# EAGLE design 2022国技館足回り (EAGLE 9.6.2)
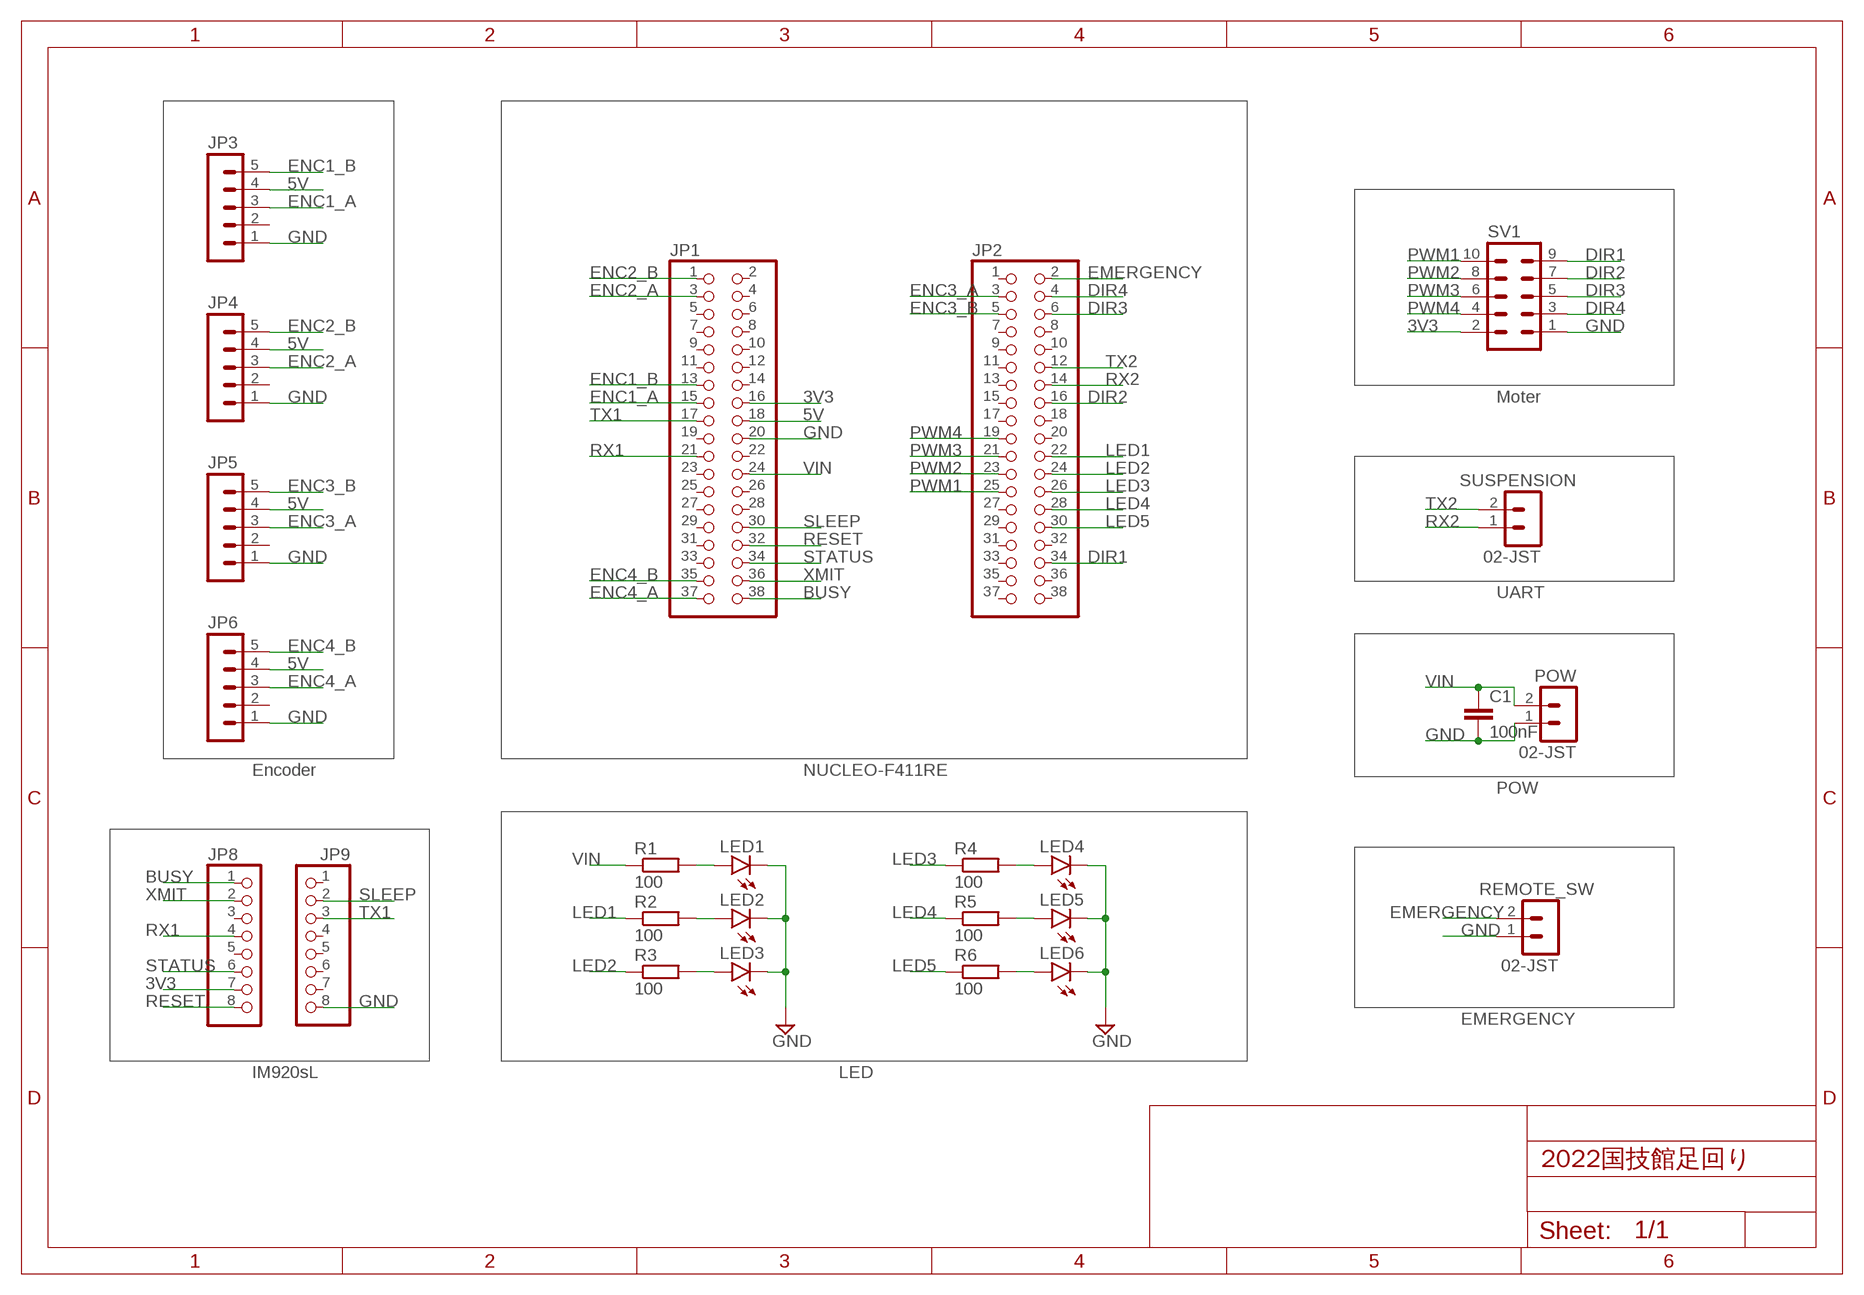
[diagram p0: schematic, sheet 1]

## Parts
C1  100nF  C-EU025-024X044  [C025-024X044]
JP1  PINHD-2X19  [2X19]
JP2  PINHD-2X19  [2X19]
JP3  05-JST  [B5B-XH]
JP4  05-JST  [B5B-XH]
JP5  05-JST  [B5B-XH]
JP6  05-JST  [B5B-XH]
JP8  PINHD-1X8  [1X08]
JP9  PINHD-1X8  [1X08]
LED1  LED5MM  [LED5MM]
LED2  LED5MM  [LED5MM]
LED3  LED5MM  [LED5MM]
LED4  LED5MM  [LED5MM]
LED5  LED5MM  [LED5MM]
LED6  LED5MM  [LED5MM]
POW  02-JST  [B2B-XH]
R1  100  R-EU_0204/7  [0204/7]
R2  100  R-EU_0207/2V  [0207/2V]
R3  100  R-EU_0207/2V  [0207/2V]
R4  100  R-EU_0207/2V  [0207/2V]
R5  100  R-EU_0207/2V  [0207/2V]
R6  100  R-EU_0207/2V  [0207/2V]
REMOTE_SW  02-JST  [B2B-XH]
SUSPENSION  02-JST  [B2B-XH]
SV1  ML10  [ML10]

## Nets
3V3: JP1.16 JP8.7 SV1.2
5V: JP1.18 JP3.4 JP4.4 JP5.4 JP6.4
BUSY: JP1.38 JP8.1
DIR1: JP2.34 SV1.9
DIR2: JP2.16 SV1.7
DIR3: JP2.6 SV1.5
DIR4: JP2.4 SV1.3
EMERGENCY: JP2.2 REMOTE_SW.2
ENC1_A: JP1.15 JP3.3
ENC1_B: JP1.13 JP3.5
ENC2_A: JP1.3 JP4.3
ENC2_B: JP1.1 JP4.5
ENC3_A: JP2.3 JP5.3
ENC3_B: JP2.5 JP5.5
ENC4_A: JP1.37 JP6.3
ENC4_B: JP1.35 JP6.5
GND: C1.2 JP1.20 JP3.1 JP4.1 JP5.1 JP6.1 JP9.8 LED1.K(C) LED2.K(C) LED3.K(C) LED4.K(C) LED5.K(C) LED6.K(C) POW.1 REMOTE_SW.1 SV1.1
LED1: JP2.22 R2.1
LED2: JP2.24 R3.1
LED3: JP2.26 R4.1
LED4: JP2.28 R5.1
LED5: JP2.30 R6.1
N$1: LED3.A R3.2
N$2: LED2.A R2.2
N$3: LED1.A R1.2
N$5: LED6.A R6.2
N$6: LED5.A R5.2
N$7: LED4.A R4.2
PWM1: JP2.25 SV1.10
PWM2: JP2.23 SV1.8
PWM3: JP2.21 SV1.6
PWM4: JP2.19 SV1.4
RESET: JP1.32 JP8.8
RX1: JP1.21 JP8.4
RX2: JP2.14 SUSPENSION.1
SLEEP: JP1.30 JP9.2
STATUS: JP1.34 JP8.6
TX1: JP1.17 JP9.3
TX2: JP2.12 SUSPENSION.2
VIN: C1.1 JP1.24 POW.2 R1.1
XMIT: JP1.36 JP8.2
Unconnected: JP1.2 JP1.4 JP1.5 JP1.6 JP1.7 JP1.8 JP1.9 JP1.10 JP1.11 JP1.12 JP1.14 JP1.19 JP1.22 JP1.23 JP1.25 JP1.26 JP1.27 JP1.28 JP1.29 JP1.31 JP1.33 JP2.1 JP2.7 JP2.8 JP2.9 JP2.10 JP2.11 JP2.13 JP2.15 JP2.17 JP2.18 JP2.20 JP2.27 JP2.29 JP2.31 JP2.32 JP2.33 JP2.35 JP2.36 JP2.37 JP2.38 JP3.2 JP4.2 JP5.2 JP6.2 JP8.3 JP8.5 JP9.1 JP9.4 JP9.5 JP9.6 JP9.7

## Notes on the sheet
- Moter
- UART
- Encoder | NUCLEO-F411RE
- POW
- EMERGENCY
- IM920sL | LED

## Library data of the parts
C1 = rcl:C-EU: CAPACITOR, European symbol; SPICEPREFIX: C
JP1 JP2 = pinhead:PINHD-2X19: PIN HEADER
JP3-JP6 = con-jst-xh:05-JST: JST CONNECTOR
JP8 JP9 = pinhead:PINHD-1X8: PIN HEADER
LED1-LED6 = led:LED: LED OSRAM: - CHIPLED LG R971, LG N971, LY N971, LG Q971, LY Q971, LO R971, LY R971 LH N974, LH R974 LS Q976, LO Q976, LY Q976 LO Q996 - Hyper CHIPLED LW Q18S LB Q993, LB Q99A, LB R99A - SideLED LS A670, LO A670, LY A670, LG A670, LP A670 LB A673, LV A673, LT A673, LW A673 LH A674 LY A675 LS A676, LA A676, LO A676, LY A676, LW A676 LS A679, LY A679, LG A679 - Hyper Micro SIDELED® LS Y876, LA Y876, LO Y876, LY Y876 LT Y87S - SmartLED LW L88C, LW L88S LB L89C, LB L89S, LG L890 LS L89K, LO L89K, LY L89K LS L896, LA L896, LO L896, LY L896 - TOPLED LS T670, LO T670, LY T670, LG T670, LP T670 LSG T670, LSP T670, LSY T670, LOP T670, LYG T670 LG T671, LOG T671, LSG T671 LB T673, LV T673, LT T673, LW T673 LH T674 LS T676, LA T676, LO T676, LY T676, LB T676, LH T676, LSB T676, LW T676 LB T67C, LV T67C, LT T67C, LS T67K, LO T67K, LY T67K, LW E67C LS E67B, LA E67B, LO E67B, LY E67B, LB E67C, LV E67C, LT E67C LW T67C LS T679, LY T679, LG T679 LS T770, LO T770, LY T770, LG T770, LP T770 LB T773, LV T773, LT T773, LW T773 LH T774 LS E675, LA E675, LY E675, LS T675 LS T776, LA T776, LO T776, LY T776, LB T776 LHGB T686 LT T68C, LB T68C - Hyper Mini TOPLED® LB M676 - Mini TOPLED Santana® LG M470 LS M47K, LO M47K, LY M47K Source: http://www.osram.convergy.de LUXEON: - LUMILED® LXK2-PW12-R00, LXK2-PW12-S00, LXK2-PW14-U00, LXK2-PW14-V00 LXK2-PM12-R00, LXK2-PM12-S00, LXK2-PM14-U00 LXK2-PE12-Q00, LXK2-PE12-R00, LXK2-PE12-S00, LXK2-PE14-T00, LXK2-PE14-U00 LXK2-PB12-K00, LXK2-PB12-L00, LXK2-PB12-M00, LXK2-PB14-N00, LXK2-PB14-P00, LXK2-PB14-Q00 LXK2-PR12-L00, LXK2-PR12-M00, LXK2-PR14-Q00, LXK2-PR14-R00 LXK2-PD12-Q00, LXK2-PD12-R00, LXK2-PD12-S00 LXK2-PH12-R00, LXK2-PH12-S00 LXK2-PL12-P00, LXK2-PL12-Q00, LXK2-PL12-R00 Source: www.luxeon.com KINGBRIGHT: KA-3528ASYC Source: www.kingbright.com
POW REMOTE_SW SUSPENSION = con-jst-xh:02-JST: JST CONNECTOR
R1-R6 = rcl:R-EU_: RESISTOR, European symbol; SPICEPREFIX: R
SV1 = con-ml:ML10: HARTING; OC_FARNELL: unknown; OC_NEWARK: unknown

## Board
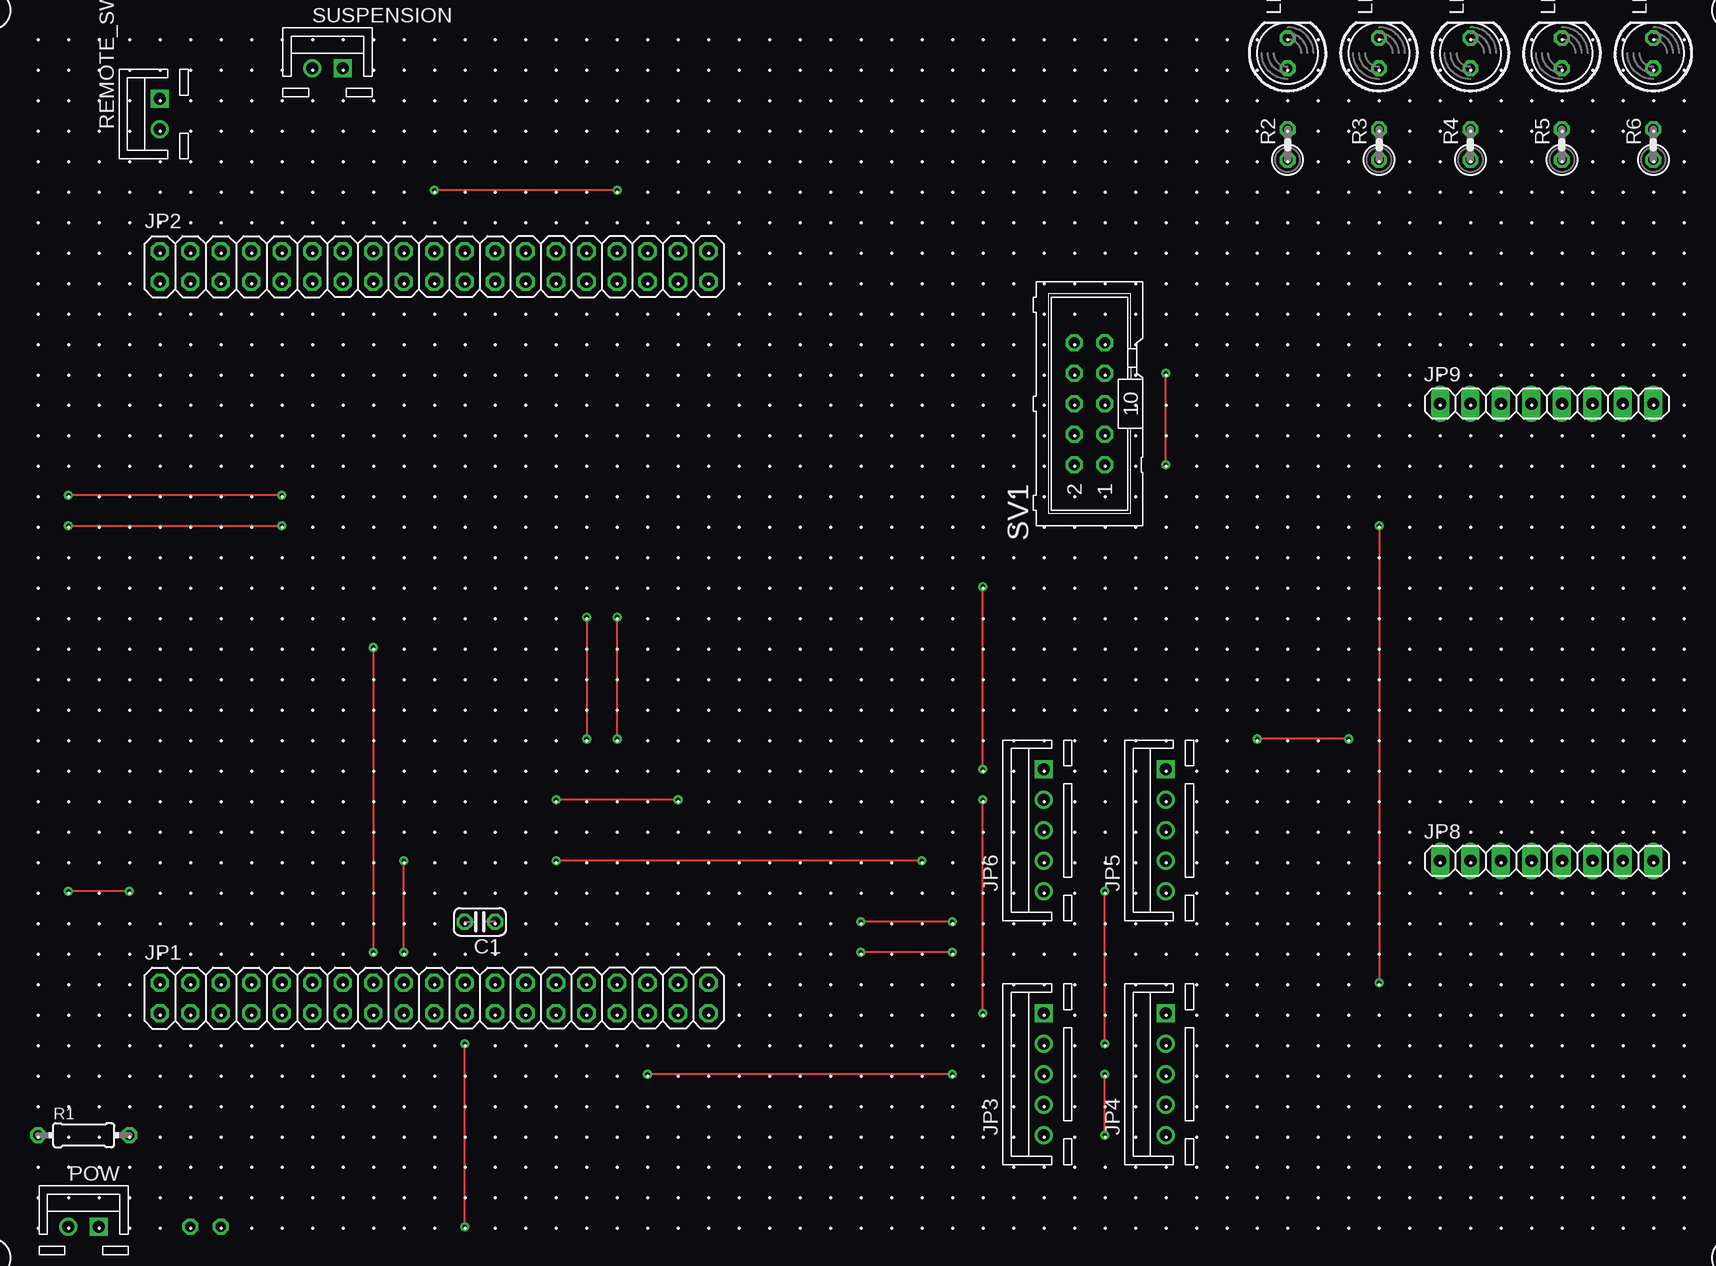
[diagram p1: board, top side]
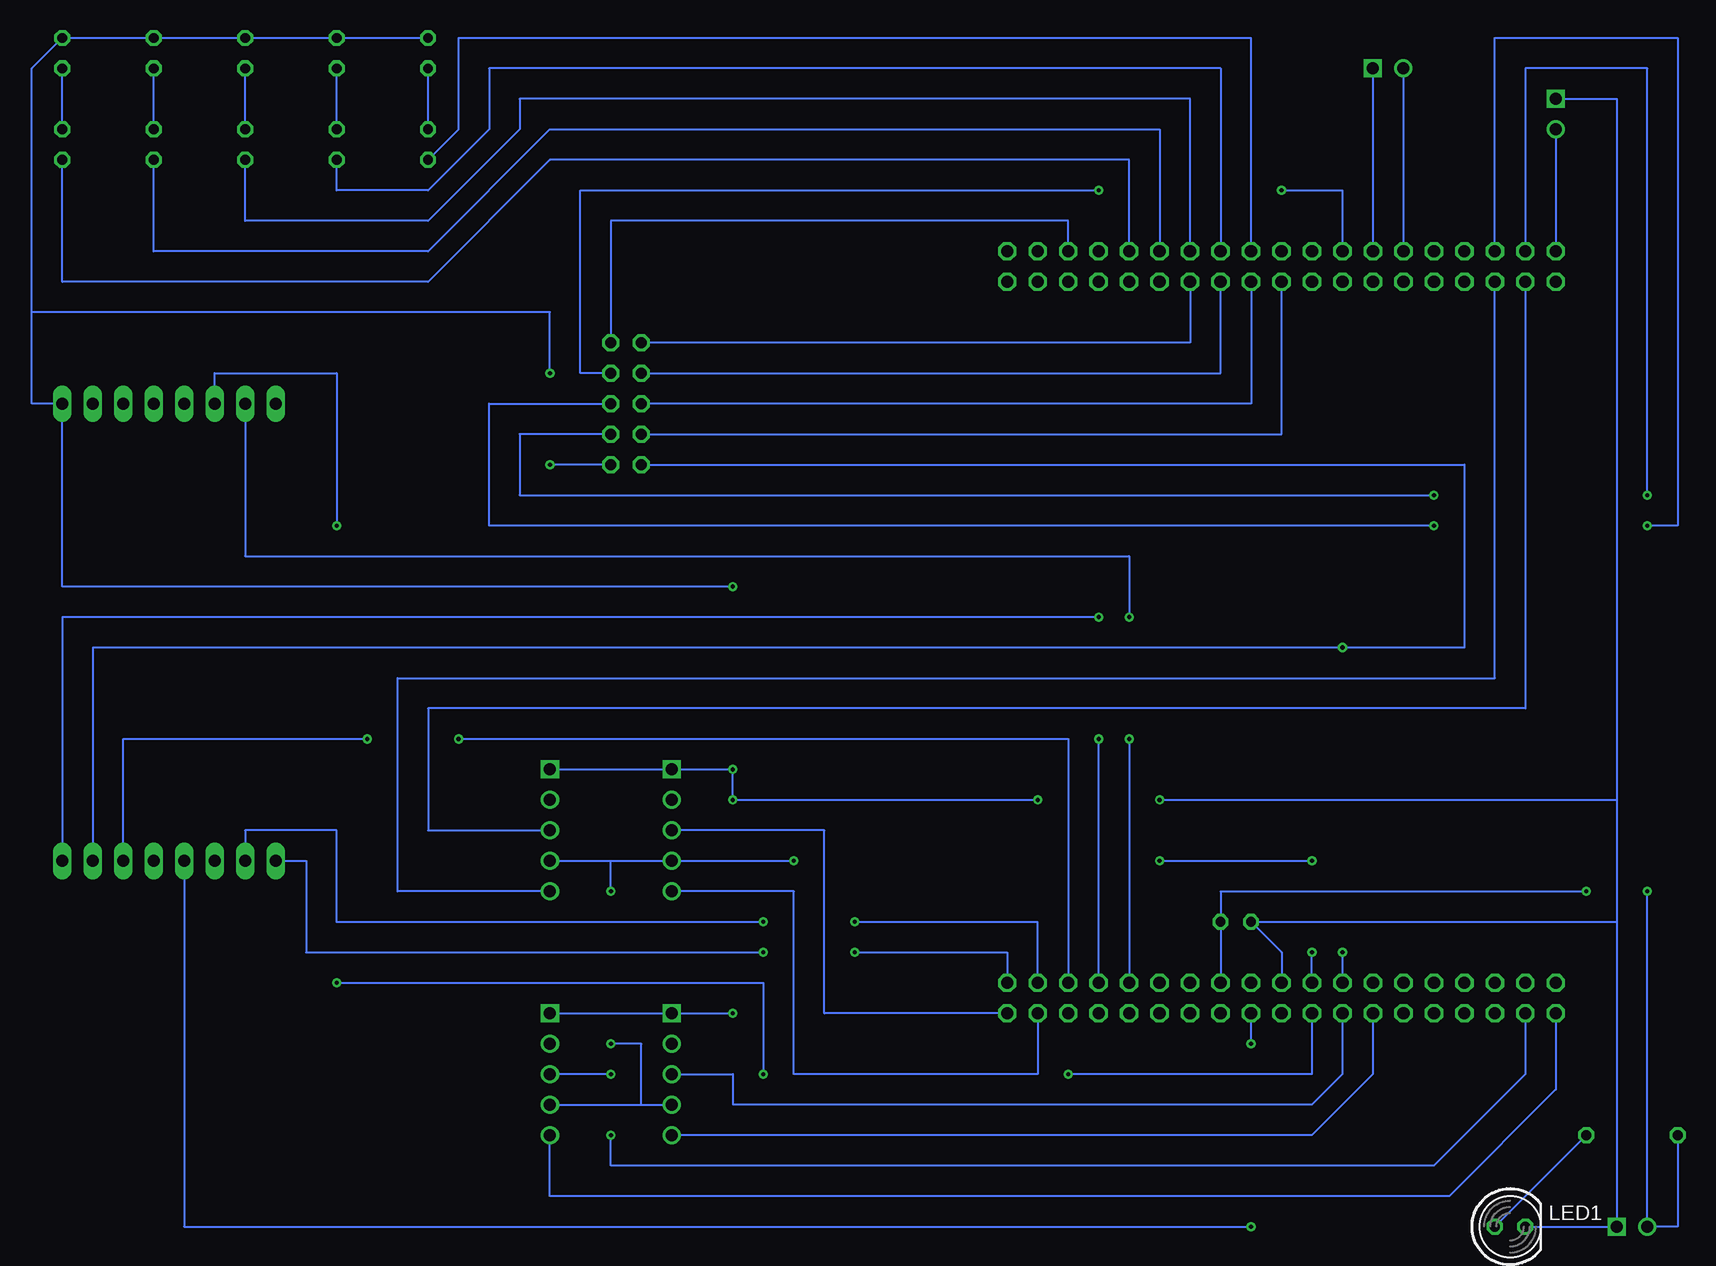
[diagram p2: board, bottom side, seen from below]

No outline drawn. Coordinates in mm, seen from the top.
Copper layers (1*16): Top 0.035mm / dielectric 1.5mm / Bottom 0.035mm
Design rules "default": minimum track width 6mil, minimum drill 0.35mm, track to track 6mil, track to pad 6mil, pad to pad 6mil, via to via 6mil, smd to smd 6mil, copper to edge 40mil, drill to drill 6mil, minimum pad ring 10mil, minimum via ring 8mil, stop-mask expansion 4mil, vias tented up to drill 0mil, thermal gap 10mil

### Footprints (pad centres in the part's own frame; a part is rotated, then mirrored left to right if it is on the bottom)
C025-024X044 = drill 0.813 octagon: 1 -1.27,0; 2 1.27,0
2X19 = drill 1.016 octagon: 1 -22.86,-1.27; 2 -22.86,1.27; 3 -20.32,-1.27; 4 -20.32,1.27; 5 -17.78,-1.27; 6 -17.78,1.27; 7 -15.24,-1.27; 8 -15.24,1.27; 9 -12.7,-1.27; 10 -12.7,1.27; 11 -10.16,-1.27; 12 -10.16,1.27; 13 -7.62,-1.27; 14 -7.62,1.27; 15 -5.08,-1.27; 16 -5.08,1.27; 17 -2.54,-1.27; 18 -2.54,1.27; 19 0,-1.27; 20 0,1.27; 21 2.54,-1.27; 22 2.54,1.27; 23 5.08,-1.27; 24 5.08,1.27; 25 7.62,-1.27; 26 7.62,1.27; 27 10.16,-1.27; 28 10.16,1.27; 29 12.7,-1.27; 30 12.7,1.27; 31 15.24,-1.27; 32 15.24,1.27; 33 17.78,-1.27; 34 17.78,1.27; 35 20.32,-1.27; 36 20.32,1.27; 37 22.86,-1.27; 38 22.86,1.27
B5B-XH = drill 1 square: 1 5.08,0 | drill 1: 2 2.54,0; 3 0,0; 4 -2.54,0; 5 -5.08,0
1X08 = drill 1.016 long: 1 -8.89,0; 2 -6.35,0; 3 -3.81,0; 4 -1.27,0; 5 1.27,0; 6 3.81,0; 7 6.35,0; 8 8.89,0
LED5MM = drill 0.813 octagon: A -1.27,0; K 1.27,0
B2B-XH = drill 1 square: 1 1.27,0 | drill 1: 2 -1.27,0
0204/7 = drill 0.813 octagon: 1 -3.81,0; 2 3.81,0
0207/2V = drill 0.813 octagon: 1 -1.27,0; 2 1.27,0
ML10 = drill 0.914 octagon: 1 -5.08,-1.27; 2 -5.08,1.27; 3 -2.54,-1.27; 4 -2.54,1.27; 5 0,-1.27; 6 0,1.27; 7 2.54,-1.27; 8 2.54,1.27; 9 5.08,-1.27; 10 5.08,1.27

### Placement (x,y rotation side)
C1  45.72,33.02 180 top
JP1  41.91,26.67 0 top
JP2  41.91,87.63 0 top
JP3  92.71,20.32 90 top
JP4  102.87,20.32 90 top
JP5  102.87,40.64 90 top
JP6  92.71,40.64 90 top
JP8  134.62,38.1 0 top
JP9  134.62,76.2 0 top
LED1  22.86,7.62 0 bottom
LED2  113.03,105.41 90 top
LED3  120.65,105.41 90 top
LED4  128.27,105.41 90 top
LED5  135.89,105.41 90 top
LED6  143.51,105.41 90 top
POW  12.7,7.62 0 top
R1  12.7,15.24 0 top
R2  113.03,97.79 90 top
R3  120.65,97.79 90 top
R4  128.27,97.79 90 top
R5  135.89,97.79 90 top
R6  143.51,97.79 90 top
REMOTE_SW  19.05,100.33 90 top
SUSPENSION  33.02,104.14 0 top
SV1  96.52,76.2 90 top
U$1  [TYPE.A]  0,0 0 top

### Tracks (layer width: path | path; a pad name or v marks a point on that pad's centre or on a via)
3V3  (via drill 0.35)
  Top 0.152: v36.83,55.88 v36.83,30.48
  Bottom 0.152: SV1.2 26.67,71.12 26.67,55.88 v36.83,55.88 140.97,55.88 JP8.7 | v36.83,30.48 JP1.16
5V  (via drill 0.35)
  Top 0.152: v97.79,22.86 v97.79,35.56 | v39.37,30.48 v39.37,38.1 | v82.55,38.1 v52.07,38.1
  Bottom 0.152: JP5.4 97.79,38.1 | 97.79,38.1 JP6.4 v82.55,38.1 | JP4.4 95.25,17.78 | 95.25,17.78 JP3.4 | 95.25,17.78 95.25,22.86 v97.79,22.86 | v97.79,35.56 97.79,38.1 | JP1.18 v39.37,30.48 | v52.07,38.1 v39.37,38.1
BUSY  (via drill 0.35)
  Top 0.152: v85.09,30.48 v77.47,30.48
  Bottom 0.152: JP8.1 123.19,38.1 123.19,30.48 v85.09,30.48 | JP1.38 64.77,30.48 v77.47,30.48
DIR1
  Bottom 0.152: JP2.34 59.69,91.44 97.79,91.44 SV1.9
DIR2  (via drill 0.35)
  Top 0.152: v57.15,93.98 v41.91,93.98
  Bottom 0.152: SV1.7 100.33,78.74 100.33,93.98 v57.15,93.98 | v41.91,93.98 36.83,93.98 JP2.16
DIR3  (via drill 0.35)
  Top 0.152: v11.43,66.04 v29.21,66.04
  Bottom 0.152: JP2.6 24.13,106.68 8.89,106.68 8.89,66.04 v11.43,66.04 | v29.21,66.04 107.95,66.04 107.95,76.2 SV1.5
DIR4  (via drill 0.35)
  Top 0.152: v29.21,68.58 v11.43,68.58
  Bottom 0.152: SV1.3 105.41,73.66 105.41,68.58 v29.21,68.58 | v11.43,68.58 11.43,104.14 21.59,104.14 JP2.4
EMERGENCY
  Bottom 0.152: REMOTE_SW.2 JP2.2
ENC1_A
  Bottom 0.152: JP3.3 87.63,20.32 87.63,17.78 39.37,17.78 36.83,20.32 JP1.15
ENC1_B
  Bottom 0.152: JP1.13 34.29,20.32 39.37,15.24 JP3.5
ENC2_A  (via drill 0.35)
  Top 0.152: v97.79,15.24 v97.79,20.32
  Bottom 0.152: v97.79,15.24 97.79,12.7 29.21,12.7 21.59,20.32 JP1.3 | v97.79,20.32 JP4.3
ENC2_B
  Bottom 0.152: JP4.5 102.87,10.16 27.94,10.16 19.05,19.05 JP1.1
ENC3_A
  Bottom 0.152: JP2.3 21.59,50.8 113.03,50.8 113.03,40.64 JP5.3
ENC3_B
  Bottom 0.152: JP5.5 115.57,35.56 115.57,53.34 24.13,53.34 JP2.5
ENC4_A
  Bottom 0.152: JP1.37 80.01,25.4 80.01,40.64 JP6.3
ENC4_B
  Bottom 0.152: JP1.35 62.23,20.32 82.55,20.32 82.55,35.56 JP6.5
GND  (via drill 0.35)
  Top 0.152: v102.87,71.12 v102.87,78.74 | v87.63,25.4 v87.63,43.18 | v62.23,43.18 v52.07,43.18 | v87.63,45.72 v87.63,60.96
  Bottom 0.152: LED2.K LED3.K LED4.K LED5.K LED6.K 146.05,104.14 146.05,83.82 | LED1.K POW.1 13.97,33.02 | JP4.1 JP3.1 v87.63,25.4 | JP5.1 JP6.1 v87.63,45.72 v87.63,43.18 v62.23,43.18 | 146.05,83.82 146.05,76.2 JP9.8 143.51,60.96 v87.63,60.96 | JP1.20 41.91,30.48 C1.2 13.97,33.02 | REMOTE_SW.1 13.97,101.6 13.97,43.18 | 13.97,43.18 13.97,33.02 | SV1.1 v102.87,71.12 | v102.87,78.74 102.87,83.82 146.05,83.82 | v52.07,43.18 13.97,43.18
LED1
  Bottom 0.152: JP2.22 44.45,106.68 110.49,106.68 110.49,99.06 R2.1
LED2
  Bottom 0.152: R3.1 120.65,93.98 113.03,93.98 107.95,99.06 107.95,104.14 46.99,104.14 JP2.24
LED3
  Bottom 0.152: JP2.26 49.53,101.6 105.41,101.6 105.41,99.06 113.03,91.44 128.27,91.44 R4.1
LED4
  Bottom 0.152: JP2.28 52.07,99.06 102.87,99.06 113.03,88.9 135.89,88.9 R5.1
LED5
  Bottom 0.152: JP2.30 54.61,96.52 102.87,96.52 113.03,86.36 143.51,86.36 R6.1
N$1
  Bottom 0.152: R3.2 LED3.A
N$2
  Bottom 0.152: R2.2 LED2.A
N$3
  Bottom 0.152: R1.2 LED1.A
N$5
  Bottom 0.152: R6.2 LED6.A
N$6
  Bottom 0.152: R5.2 LED5.A
N$7
  Bottom 0.152: R4.2 LED4.A
PWM1
  Bottom 0.152: JP2.25 49.53,81.28 SV1.10
PWM2
  Bottom 0.152: SV1.8 46.99,78.74 JP2.23
PWM3
  Bottom 0.152: JP2.21 44.45,76.2 SV1.6
PWM4
  Bottom 0.152: SV1.4 41.91,73.66 JP2.19
RESET  (via drill 0.35)
  Top 0.152: v57.15,48.26 v57.15,58.42
  Bottom 0.152: JP1.32 v57.15,48.26 | v57.15,58.42 143.51,58.42 JP8.8
RX1  (via drill 0.35)
  Top 0.152: v44.45,7.62 v44.45,22.86
  Bottom 0.152: JP8.4 133.35,7.62 v44.45,7.62 | v44.45,22.86 JP1.21
RX2
  Bottom 0.152: SUSPENSION.1 JP2.14
SLEEP  (via drill 0.35)
  Top 0.152: v54.61,58.42 v54.61,48.26
  Bottom 0.152: JP9.2 128.27,63.5 54.61,63.5 v54.61,58.42 | v54.61,48.26 JP1.30
STATUS  (via drill 0.35)
  Top 0.152: v118.11,48.26 v110.49,48.26
  Bottom 0.152: JP8.6 138.43,48.26 v118.11,48.26 | v110.49,48.26 59.69,48.26 JP1.34
TX1  (via drill 0.35)
  Top 0.152: v120.65,66.04 v120.65,27.94 | v85.09,20.32 v59.69,20.32
  Bottom 0.152: JP9.3 130.81,78.74 120.65,78.74 v120.65,66.04 | v120.65,27.94 85.09,27.94 v85.09,20.32 | JP1.17 39.37,20.32 v59.69,20.32
TX2
  Bottom 0.152: SUSPENSION.2 JP2.12
VIN  (via drill 0.35)
  Top 0.152: v16.51,35.56 v11.43,35.56
  Bottom 0.152: JP1.24 C1.1 46.99,35.56 v16.51,35.56 | v11.43,35.56 POW.2 8.89,7.62 R1.1
XMIT  (via drill 0.35)
  Top 0.152: v85.09,33.02 v77.47,33.02
  Bottom 0.152: JP1.36 62.23,33.02 v77.47,33.02 | v85.09,33.02 120.65,33.02 120.65,40.64 128.27,40.64 JP8.2